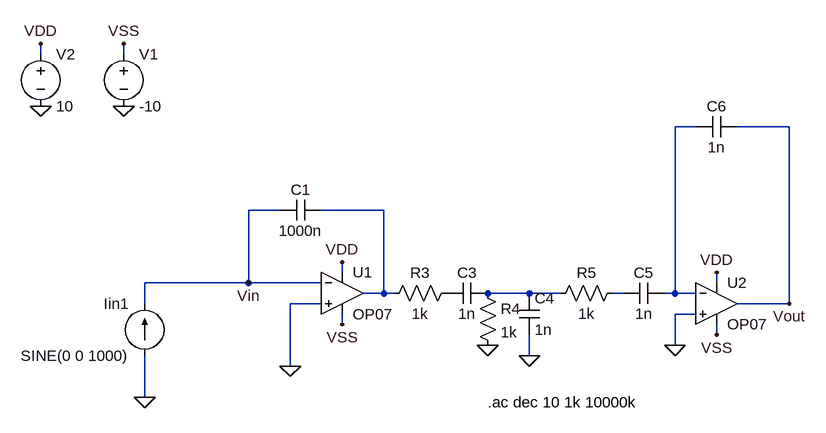
[diagram p0: schematic TIA-ALL_Z-3rd-order_LP.asc]
TIA-ALL_Z-3rd-order_LP.asc, the LTspice schematic file:
Version 4
SHEET 1 1064 680
WIRE -128 96 -128 80
WIRE 0 96 0 80
WIRE 880 208 848 208
WIRE 1024 208 944 208
WIRE 240 336 192 336
WIRE 400 336 304 336
WIRE 336 432 336 416
WIRE 192 448 192 336
WIRE 192 448 32 448
WIRE 304 448 192 448
WIRE 912 448 912 432
WIRE 400 464 400 336
WIRE 400 464 368 464
WIRE 416 464 400 464
WIRE 624 464 560 464
WIRE 672 464 624 464
WIRE 768 464 752 464
WIRE 848 464 848 208
WIRE 848 464 832 464
WIRE 880 464 848 464
WIRE 32 480 32 448
WIRE 304 480 256 480
WIRE 1024 480 1024 208
WIRE 1024 480 944 480
WIRE 880 496 848 496
WIRE 336 512 336 496
WIRE 912 528 912 512
WIRE 848 544 848 496
WIRE 624 560 624 528
WIRE 256 576 256 480
WIRE 32 624 32 560
FLAG 0 176 0
FLAG -128 176 0
FLAG -128 80 VDD
FLAG 0 80 VSS
FLAG 336 416 VDD
FLAG 336 512 VSS
FLAG 32 624 0
FLAG 256 576 0
FLAG 912 432 VDD
FLAG 912 528 VSS
FLAG 848 544 0
FLAG 1024 480 Vout
FLAG 624 560 0
FLAG 560 544 0
FLAG 192 448 Vin
SYMBOL OP07 336 400 R0
SYMATTR InstName U1
SYMBOL voltage 0 80 R0
SYMATTR InstName V1
SYMATTR Value -10
SYMBOL voltage -128 80 R0
SYMATTR InstName V2
SYMATTR Value 10
SYMBOL current 32 560 R180
WINDOW 0 24 80 Left 2
WINDOW 3 24 0 Left 2
SYMATTR InstName Iin1
SYMATTR Value SINE(0 0 1000)
SYMATTR Value2 AC 10 m
SYMBOL OP07 912 416 R0
SYMATTR InstName U2
SYMBOL Cap 304 320 R90
WINDOW 0 0 32 VBottom 2
WINDOW 3 32 32 VTop 2
SYMATTR InstName C1
SYMATTR Value 1000n
SYMBOL Res 512 448 R90
WINDOW 0 0 56 VBottom 2
WINDOW 3 32 56 VTop 2
SYMATTR InstName R3
SYMATTR Value 1k
SYMBOL Cap 560 448 R90
WINDOW 0 0 32 VBottom 2
WINDOW 3 32 32 VTop 2
SYMATTR InstName C3
SYMATTR Value 1n
SYMBOL Res 544 448 R0
SYMATTR InstName R4
SYMATTR Value 1k
SYMBOL Cap 608 464 R0
SYMATTR InstName C4
SYMATTR Value 1n
SYMBOL Res 768 448 R90
WINDOW 0 0 56 VBottom 2
WINDOW 3 32 56 VTop 2
SYMATTR InstName R5
SYMATTR Value 1k
SYMBOL Cap 832 448 R90
WINDOW 0 0 32 VBottom 2
WINDOW 3 32 32 VTop 2
SYMATTR InstName C5
SYMATTR Value 1n
SYMBOL Cap 944 192 R90
WINDOW 0 0 32 VBottom 2
WINDOW 3 32 32 VTop 2
SYMATTR InstName C6
SYMATTR Value 1n
TEXT 560 632 Left 2 !.ac dec 10 1k 10000k

The netlist it stands for:
* TIA-ALL_Z-3rd-order_LP.asc
XU1 0 Vin VDD VSS N002 LT1001  ; OP07, pins In+ In- V+ V- OUT
V1 VSS 0 -10
V2 VDD 0 10
Iin1 0 Vin SINE(0 0 1000) AC 10 m
XU2 0 N001 VDD VSS Vout LT1001  ; OP07, pins In+ In- V+ V- OUT
C1 N002 Vin 1000n
R3 P001 N002 1k
C3 N003 P001 1n
R4 N003 0 1k
C4 N003 0 1n
R5 N004 N003 1k
C5 N001 N004 1n
C6 Vout N001 1n
.ac dec 10 1k 10000k
.lib LTC.lib
.backanno
.end